# Altium project CAN_GPIO_1.0_RW.PrjPcb
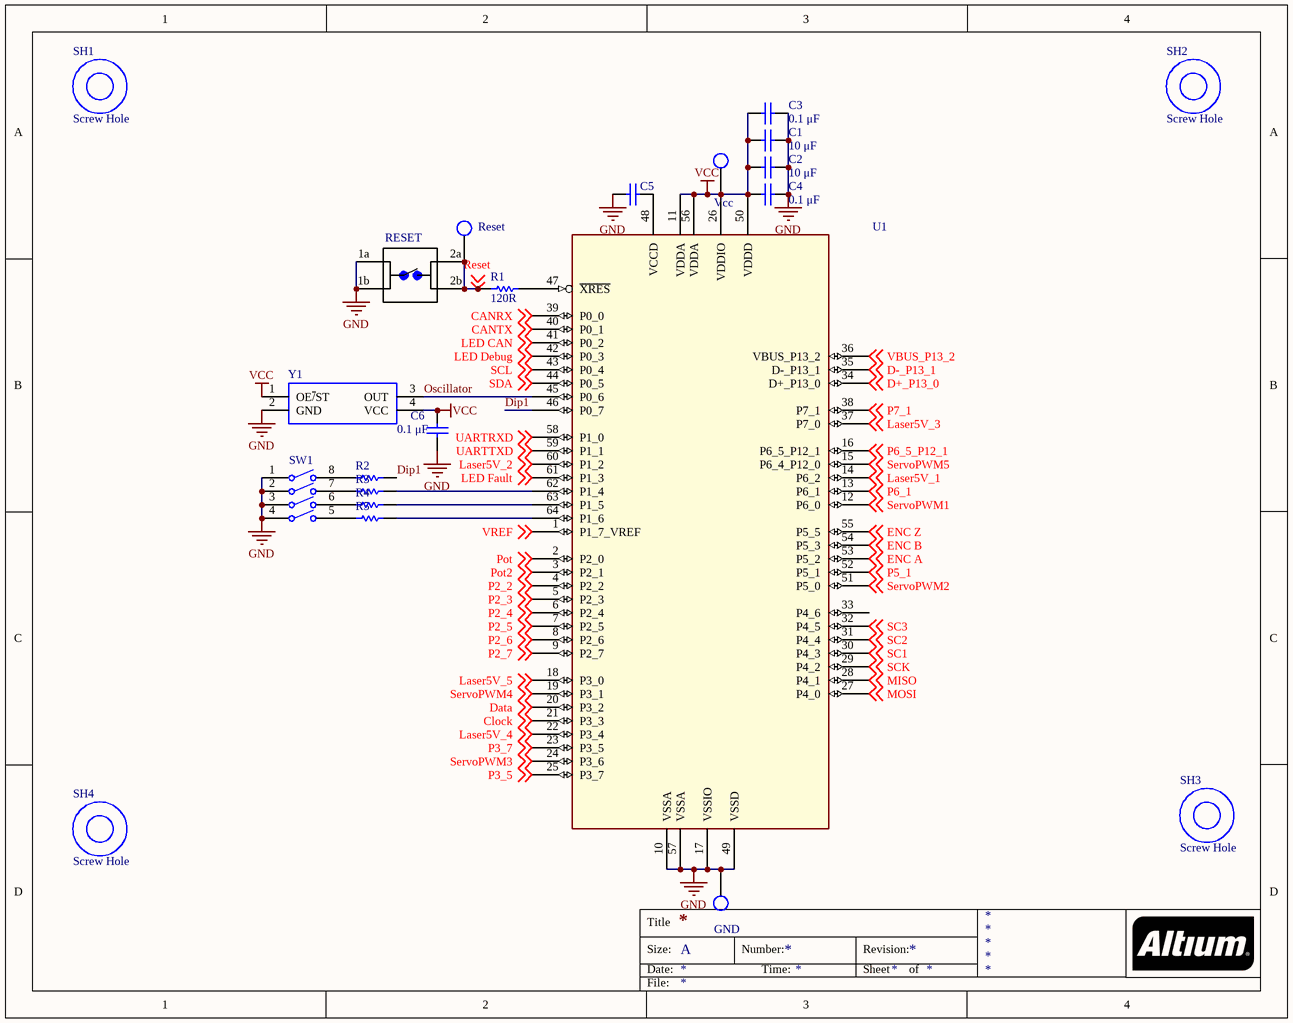
[diagram p0: PSoC.SchDoc]
4 sheets, 141 parts. Net scope: global (net labels, ports and power ports of the same name join across sheets).
Board file: CAN_GPIO_1.0_RW.PcbDoc
Sheets:
  PSoC.SchDoc
  CAN.SchDoc
  LEDs.SchDoc
  Connectors.SchDoc

## Sheet PSoC.SchDoc
size A

### Parts
C1  10 μF  [Cap 0805]
C2  10 μF  [Cap 0805]
C3  0.1 μF  [Cap 0805]
C4  0.1 μF  [Cap 0805]
C5  1 μF  [Cap 0805]  (value not drawn)
C6  0.1 μF  [Cap 0805]
GND  Test Point  [Test Point pad]  (value not drawn)
R1  value 120R  [RESC0805(2012)_N]  (hidden comment: Resistor 0805)
R2  Resistor 0805  [RESC0805(2012)_N]  (value not drawn)
R3  Resistor 0805  [RESC0805(2012)_N]  (value not drawn)
R4  Resistor 0805  [RESC0805(2012)_N]  (value not drawn)
R5  Resistor 0805  [RESC0805(2012)_N]  (value not drawn)
RESET  1825910-7  [Switch 6mm 24V (NO)]  (value not drawn)
Reset  Test Point  [Test Point pad]  (value not drawn)
SH1  Screw Hole  [Screw Hole]
SH2  Screw Hole  [Screw Hole]
SH3  Screw Hole  [Screw Hole]
SH4  Screw Hole  [Screw Hole]
SW1  TDA04H0SB1  [CKCP-TDA04H0SB1R_V]  (value not drawn)
U1  CY8C4248AZI-L485  [TQFP50P1200X1200X160-64N]  (value not drawn)
Vcc  Test Point  [Test Point pad]  (value not drawn)
Y1  SG-636PCW_50.0000MC3__ROHS  [SG-636_3D]  (value not drawn)

### Nets
GND: C1.1 C2.2 C3.1 C4.2 C5.1 C6.1 GND.1 RESET.1a RESET.1b SW1.1 SW1.2 SW1.3 SW1.4 U1.10(VSSA) U1.17(VSSIO) U1.49(VSSD) U1.57(VSSA) Y1.2(GND)
VCC: C1.2 C2.1 C3.2 C4.1 C6.2 U1.11(VDDA) U1.26(VDDIO) U1.50(VDDD) U1.56(VDDA) Vcc.1 Y1.1(OE~{/}ST) Y1.4(VCC)
CANRX: U1.39(P0_0) ; off-sheet CANRX
CANTX: U1.40(P0_1) ; off-sheet CANTX
Clock: U1.21(P3_3) ; off-sheet Clock
D+_P13_0: U1.34(D+_P13_0) ; off-sheet D+_P13_0
D-_P13_1: U1.35(D-_P13_1) ; off-sheet D-_P13_1
Data: U1.20(P3_2) ; off-sheet Data
Dip1: R2.2 U1.46(P0_7)
ENC A: U1.53(P5_2) ; off-sheet ENC A
ENC B: U1.54(P5_3) ; off-sheet ENC B
ENC Z: U1.55(P5_5) ; off-sheet ENC Z
Laser5V_1: U1.14(P6_2) ; off-sheet Laser5V_1
Laser5V_2: U1.60(P1_2) ; off-sheet Laser5V_2
Laser5V_3: U1.37(P7_0) ; off-sheet Laser5V_3
Laser5V_4: U1.22(P3_4) ; off-sheet Laser5V_4
Laser5V_5: U1.18(P3_0) ; off-sheet Laser5V_5
LED CAN: U1.41(P0_2) ; off-sheet LED CAN
LED Debug: U1.42(P0_3) ; off-sheet LED Debug
LED Fault: U1.61(P1_3) ; off-sheet LED Fault
MISO: U1.28(P4_1) ; off-sheet MISO
MOSI: U1.27(P4_0) ; off-sheet MOSI
Oscillator: U1.45(P0_6) Y1.3(OUT)
P2_2: U1.4(P2_2) ; off-sheet P2_2
P2_3: U1.5(P2_3) ; off-sheet P2_3
P2_4: U1.6(P2_4) ; off-sheet P2_4
P2_5: U1.7(P2_5) ; off-sheet P2_5
P2_6: U1.8(P2_6) ; off-sheet P2_6
P2_7: U1.9(P2_7) ; off-sheet P2_7
P3_5: U1.25(P3_7) ; off-sheet P3_5
P3_7: U1.23(P3_5) ; off-sheet P3_7
P5_1: U1.52(P5_1) ; off-sheet P5_1
P6_1: U1.13(P6_1) ; off-sheet P6_1
P6_5_P12_1: U1.16(P6_5_P12_1) ; off-sheet P6_5_P12_1
P7_1: U1.38(P7_1) ; off-sheet P7_1
Pot: U1.2(P2_0) ; off-sheet Pot
Pot2: U1.3(P2_1) ; off-sheet Pot2
Reset: R1.1 Reset.1 RESET.2a RESET.2b ; off-sheet Reset
SC1: U1.30(P4_3) ; off-sheet SC1
SC2: U1.31(P4_4) ; off-sheet SC2
SC3: U1.32(P4_5) ; off-sheet SC3
SCK: U1.29(P4_2) ; off-sheet SCK
SCL: U1.43(P0_4) ; off-sheet SCL
SDA: U1.44(P0_5) ; off-sheet SDA
ServoPWM1: U1.12(P6_0) ; off-sheet ServoPWM1
ServoPWM2: U1.51(P5_0) ; off-sheet ServoPWM2
ServoPWM3: U1.24(P3_6) ; off-sheet ServoPWM3
ServoPWM4: U1.19(P3_1) ; off-sheet ServoPWM4
ServoPWM5: U1.15(P6_4_P12_0) ; off-sheet ServoPWM5
UARTRXD: U1.58(P1_0) ; off-sheet UARTRXD
UARTTXD: U1.59(P1_1) ; off-sheet UARTTXD
VBUS_P13_2: U1.36(VBUS_P13_2) ; off-sheet VBUS_P13_2
VREF: U1.1(P1_7_VREF) ; off-sheet VREF
NetC5_2: C5.2 U1.48(VCCD)
NetR1_2: R1.2 U1.47(~{XRES})
NetR2_1: R2.1 SW1.8
NetR3_1: R3.1 SW1.7
NetR3_2: R3.2 U1.62(P1_4)
NetR4_1: R4.1 SW1.6
NetR4_2: R4.2 U1.63(P1_5)
NetR5_1: R5.1 SW1.5
NetR5_2: R5.2 U1.64(P1_6)

Not connected (* = marked no-connect by the designer): U1 33(P4_6)

### Notes on the sheet
- Title
- Size:
- Date:
- A
- Number:
- Time:
- Revision:
- Sheet
- of
- File:

### Library data of the parts
C1-C6 = Capacitor 0805: Standard Capacitor; Mounting Technology: SurfaceMount; Case Size/Dimension: 0805; Package Reference: 0805
  C1 C2: Capacitance: 10 μF
  C3 C4 C6: Capacitance: 0.1 μF
  C5: Capacitance: 1 μF
R1 = Resistor 0805: Generic 0805 Resistor; Tolerance: 5 %; Case-Metric: 2012; Case-EIA: 0805; Power: 0.125 W; Technology: SMT
R2-R5 = Resistor 0805: Generic 0805 Resistor; Value: 120R; Case-EIA: 0805; Tolerance: 5 %; Case-Metric: 2012; Power: 0.125 W; Technology: SMT
RESET = Switch 6mm 24V (NO): FSM4JAH=6MM TACT SWITCH, HIGH TEMP; MF: TE Connectivity; Contact_Current_Rating: 50 mA; Configuration_Pole-Throw: Single Pole - Single Throw; Package: None; Digi-Key_Part_Number: 450-1804-ND; Digi-Key_Purchase_URL: https://www.digikey.com/product-detail/en/te-connectivity-alcoswitch-switches/1825910-7/450-1804-ND/1731414?utm_source=snapeda&utm_medium=aggregator&utm_campaign=symbol; MP: 1825910-7; SnapEDA_Link: https://www.snapeda.com/parts/1825910-7/TE%20Connectivity%20ALCOSWITCH%20Switches/view-part/?ref=snap; EU_RoHS_Compliance: Compliant; TE_purchase_URL: https://www.te.com/usa-en/product-1825910-7.html?te_bu=Cor&te_type=disp&te_campaign=seda_glo_cor-seda-global-disp-prtnr-fy19-seda-model-bom-cta_sma-317_1&elqCampaignId=32493; Value: *
SH1-SH4 = Screw Hole: Add 4 of these to your design for screw hole mounting
SW1 = Dip Switch Array SMD Half-Pitch: Ultra-Miniature Surface Mount Half-Pitch DIP Switch, 25 mA, 24 V, -40 to 85 degC, 8-Pin SMD, RoHS, Tube; Contact Current Rating: 100 mA; Throw Configuration: SPST; Voltage Rating (DC): 24 V; Max Contact Resistance: 100 mohm; Max Current Rating: 25 mA; REACH SVHC: No SVHC; DatasheetVersion: 02/2016; Case\Package: DIP; Package Quantity: 70; Lead Pitch: 1.27 mm; Contact Plating: Gold; Packaging: Rail/Tube; Contact Finish: Gold; Mount: Surface Mount; Height: 2.3 mm; Contact Material: Copper; Max Operating Temperature: 85 degC; Max Voltage Rating (DC): 24 V; ComponentLink1URL: http://www.ck-components.com/media/1328/tda.pdf; PackageDescription: 8-Pin Surface Mount Device, Body 6.21 x 6.2 mm, Pitch 1.27 mm; Radiation Hardening: No; ComponentLink1Description: Datasheet; Current Rating: 100 mA; RoHSCompliant: true; PackageReference: TDA04H0SB1R; Min Operating Temperature: -40 degC; Pins: 4; Mounting Technology: Surface Mount; Length: 6.21 mm
U1 = PSOC MC: 64 pin psoc; Part_Number: CY8C4248AZI-L485
Y1 = Oscilator: Standard Clock Oscillators; Manufacturer_Name: Epson Timing; Manufacturer_Part_Number: SG-636PCW 50.0000MC3: ROHS; RS Part Number: *; RS Price/Stock: *; Arrow Part Number: SG-636PCW 50.0000MC3: ROHS; Arrow Price/Stock: *; Datasheet Link: http://www.mouser.com/ds/2/137/G-636PCE_en-1003252.pdf

## Sheet CAN.SchDoc
size A
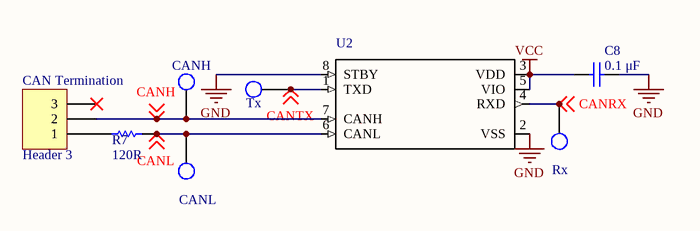
[diagram p1: CAN.SchDoc]

### Parts
(Parts that share a designator on the sheet are numbered #1, #2 ... from top to bottom, then left to right.)
C8  0.1 μF  [Cap 0805]
CAN_Termination  Header 3  [HDR1X3]
CANH  Test Point  [Test Point pad]  (value not drawn)
CANL#1  Test Point  [Test Point pad]  (value not drawn)
R7  120R  [RESC0805(2012)_N]
Rx  Test Point  [Test Point Through-hole]  (value not drawn)
Tx  Test Point  [Test Point Through-hole]  (value not drawn)
U2  MCP2562-E/SN  [SOIC127P600X175-8N]  (value not drawn)

### Nets
GND: C8.2 U2.2(VSS) U2.8(STBY)
VCC: C8.1 U2.3(VDD) U2.5(VIO)
CANH: CAN_Termination.2 CANH.1 U2.7(CANH) ; off-sheet CANH
CANL: CANL#1.1 R7.1 U2.6(CANL) ; off-sheet CANL
CANRX: Rx.1 U2.4(RXD) ; off-sheet CANRX
CANTX: Tx.1 U2.1(TXD) ; off-sheet CANTX
NetCAN_Termination_1: CAN_Termination.1 R7.2

Not connected (* = marked no-connect by the designer): CAN_Termination 3*

### Notes on the sheet
- Title
- Size:
- Date:
- A
- Number:
- Time:
- Revision:
- Sheet
- of
- File:

### Library data of the parts
C8 = Capacitor 0805: Standard Capacitor; Mounting Technology: SurfaceMount; Case Size/Dimension: 0805; Package Reference: 0805; Capacitance: 0.1 μF
CAN_Termination = Header 3: Header, 3-Pin; LatestRevisionDate: 17-Jul-2002; LatestRevisionNote: Re-released for DXP Platform.; Publisher: Altium Limited
R7 = Resistor 0805: as R1 on sheet PSoC; Technology: SMT; Value: 120R
U2 = CAN Tranceiver: Microchip MCP2562-E/SN, CAN Transceiver 1MBps 1-channel IEC 61000-4-2, 8-Pin SOIC; Price: None; MF: Microchip; SnapEDA_Link: https://www.snapeda.com/parts/MCP2562-E/SN/Microchip/view-part/?ref=snap; MP: MCP2562-E/SN; Availability: Unavailable; Package: SO-8 Microchip; Value: *

## Sheet LEDs.SchDoc
size A
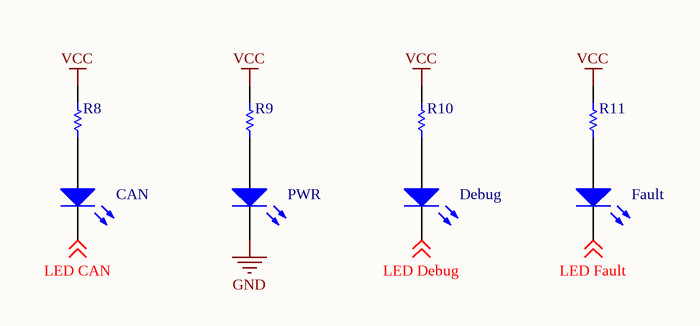
[diagram p2: LEDs.SchDoc]

### Parts
CAN  LED  [0805_A]  (value not drawn)
Debug  LED  [0805_A]  (value not drawn)
Fault  LED  [0805_A]  (value not drawn)
PWR  LED  [0805_A]  (value not drawn)
R8  Resistor 0805  [RESC0805(2012)_N]  (value not drawn)
R9  Resistor 0805  [RESC0805(2012)_N]  (value not drawn)
R10  Resistor 0805  [RESC0805(2012)_N]  (value not drawn)
R11  Resistor 0805  [RESC0805(2012)_N]  (value not drawn)

### Nets
GND: PWR.1(K)
VCC: R8.1 R9.1 R10.1 R11.1
LED CAN: CAN.1(K) ; off-sheet LED CAN
LED Debug: Debug.1(K) ; off-sheet LED Debug
LED Fault: Fault.1(K) ; off-sheet LED Fault
NetCAN_2: CAN.2(A) R8.2
NetDebug_2: Debug.2(A) R10.2
NetFault_2: Fault.2(A) R11.2
NetPWR_2: PWR.2(A) R9.2

### Notes on the sheet
- Title
- Size:
- Date:
- A
- Number:
- Time:
- Revision:
- Sheet
- of
- File:

### Library data of the parts
CAN Fault = LED: Standard 0805 LED; Manufacturer: Wuerth Elektronik; PartNumber: 150080SS75000; PackageReference: 0805_A
  CAN: Color: Blue
  Fault: ComponentLink2URL: http://katalog.we-online.com/led/datasheet/150080SS75000.pdf; ComponentLink1URL: http://www.we-online.com; Color: Super Red; ComponentLink2Description: Datasheet; ComponentLink1Description: Manufacturer URL
Debug PWR = LED: Standard 0805 LED; PackageReference: 0805_A
  Debug: Color: Green
  PWR: Color: Yellow
R8-R11 = Resistor 0805: as R2 on sheet PSoC; Technology: SMT

## Sheet Connectors.SchDoc
size A
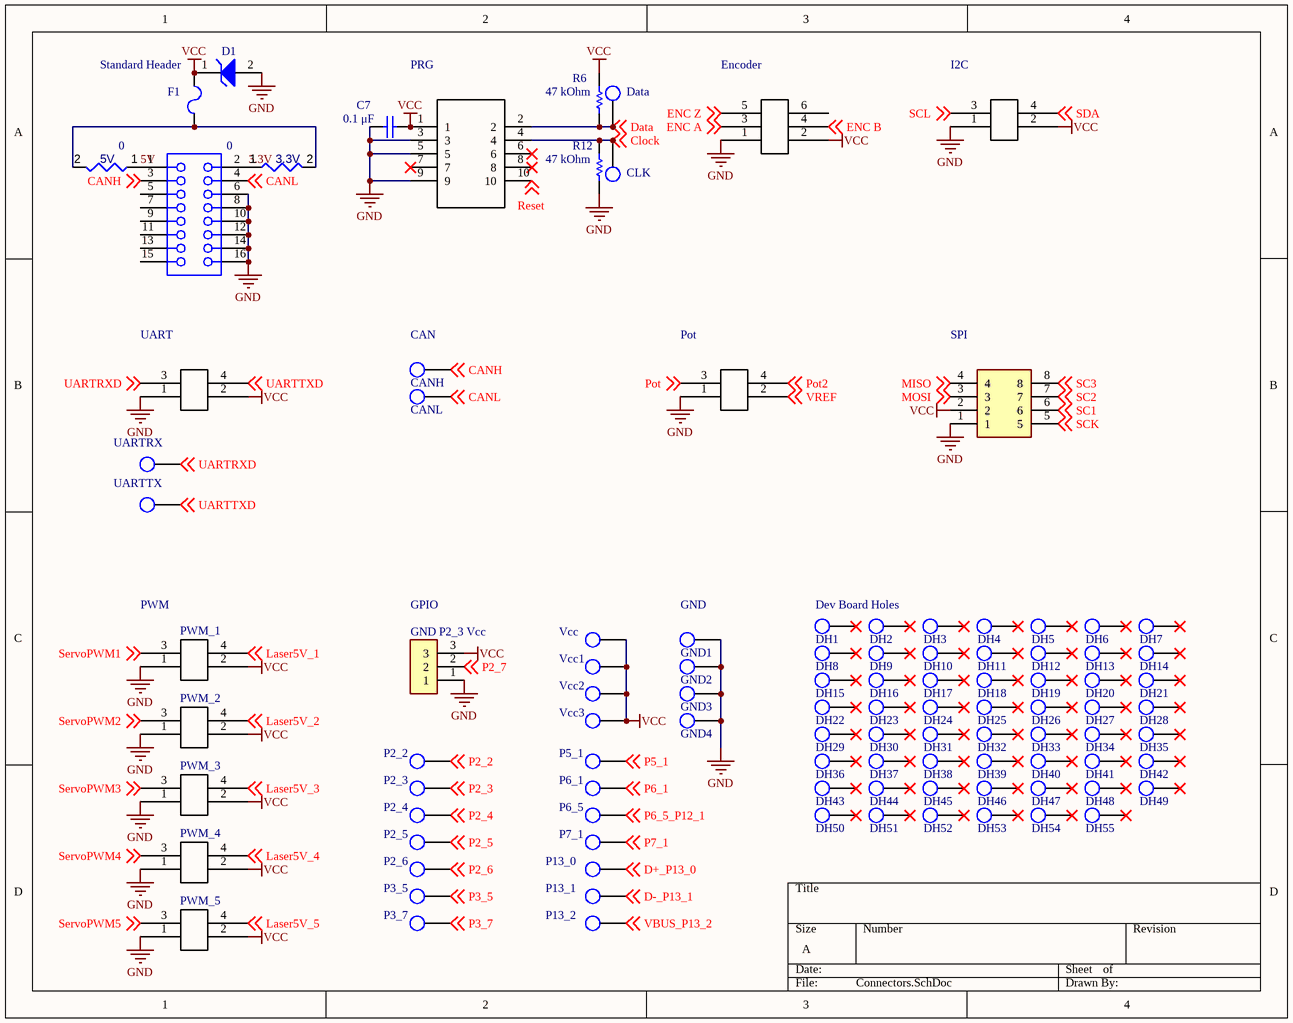
[diagram p3: Connectors.SchDoc]

### Parts
(Parts that share a designator on the sheet are numbered #1, #2 ... from top to bottom, then left to right.)
3.3V  value 0  [RESC0402(1005)_L]  (hidden comment: Jumper)
5V  value 0  [RESC0402(1005)_L]  (hidden comment: Jumper)
C7  0.1 μF  [Cap 0805]
CANH  Test Point  [Test Point Through-hole]  (value not drawn)
CANL#2  Test Point  [Test Point Through-hole]  (value not drawn)
CLK  Test Point  [Test Point pad]  (value not drawn)
D1  1SMB5917BT3G  [ONSC-SMB-2-403A-03_H_V]  (value not drawn)
Data  Test Point  [Test Point pad]  (value not drawn)
DH1  Test Point  [Test Point Through-hole]  (value not drawn)
DH2  Test Point  [Test Point Through-hole]  (value not drawn)
DH3  Test Point  [Test Point Through-hole]  (value not drawn)
DH4  Test Point  [Test Point Through-hole]  (value not drawn)
DH5  Test Point  [Test Point Through-hole]  (value not drawn)
DH6  Test Point  [Test Point Through-hole]  (value not drawn)
DH7  Test Point  [Test Point Through-hole]  (value not drawn)
DH8  Test Point  [Test Point Through-hole]  (value not drawn)
DH9  Test Point  [Test Point Through-hole]  (value not drawn)
DH10  Test Point  [Test Point Through-hole]  (value not drawn)
DH11  Test Point  [Test Point Through-hole]  (value not drawn)
DH12  Test Point  [Test Point Through-hole]  (value not drawn)
DH13  Test Point  [Test Point Through-hole]  (value not drawn)
DH14  Test Point  [Test Point Through-hole]  (value not drawn)
DH15  Test Point  [Test Point Through-hole]  (value not drawn)
DH16  Test Point  [Test Point Through-hole]  (value not drawn)
DH17  Test Point  [Test Point Through-hole]  (value not drawn)
DH18  Test Point  [Test Point Through-hole]  (value not drawn)
DH19  Test Point  [Test Point Through-hole]  (value not drawn)
DH20  Test Point  [Test Point Through-hole]  (value not drawn)
DH21  Test Point  [Test Point Through-hole]  (value not drawn)
DH22  Test Point  [Test Point Through-hole]  (value not drawn)
DH23  Test Point  [Test Point Through-hole]  (value not drawn)
DH24  Test Point  [Test Point Through-hole]  (value not drawn)
DH25  Test Point  [Test Point Through-hole]  (value not drawn)
DH26  Test Point  [Test Point Through-hole]  (value not drawn)
DH27  Test Point  [Test Point Through-hole]  (value not drawn)
DH28  Test Point  [Test Point Through-hole]  (value not drawn)
DH29  Test Point  [Test Point Through-hole]  (value not drawn)
DH30  Test Point  [Test Point Through-hole]  (value not drawn)
DH31  Test Point  [Test Point Through-hole]  (value not drawn)
DH32  Test Point  [Test Point Through-hole]  (value not drawn)
DH33  Test Point  [Test Point Through-hole]  (value not drawn)
DH34  Test Point  [Test Point Through-hole]  (value not drawn)
DH35  Test Point  [Test Point Through-hole]  (value not drawn)
DH36  Test Point  [Test Point Through-hole]  (value not drawn)
DH37  Test Point  [Test Point Through-hole]  (value not drawn)
DH38  Test Point  [Test Point Through-hole]  (value not drawn)
DH39  Test Point  [Test Point Through-hole]  (value not drawn)
DH40  Test Point  [Test Point Through-hole]  (value not drawn)
DH41  Test Point  [Test Point Through-hole]  (value not drawn)
DH42  Test Point  [Test Point Through-hole]  (value not drawn)
DH43  Test Point  [Test Point Through-hole]  (value not drawn)
DH44  Test Point  [Test Point Through-hole]  (value not drawn)
DH45  Test Point  [Test Point Through-hole]  (value not drawn)
DH46  Test Point  [Test Point Through-hole]  (value not drawn)
DH47  Test Point  [Test Point Through-hole]  (value not drawn)
DH48  Test Point  [Test Point Through-hole]  (value not drawn)
DH49  Test Point  [Test Point Through-hole]  (value not drawn)
DH50  Test Point  [Test Point Through-hole]  (value not drawn)
DH51  Test Point  [Test Point Through-hole]  (value not drawn)
DH52  Test Point  [Test Point Through-hole]  (value not drawn)
DH53  Test Point  [Test Point Through-hole]  (value not drawn)
DH54  Test Point  [Test Point Through-hole]  (value not drawn)
DH55  Test Point  [Test Point Through-hole]  (value not drawn)
Encoder  Molex Micro  [MICROFIT R/A 6 PIN]  (value not drawn)
F1  MF-NSMF150-2  [BOUR-MF-NSMF150-2_V]  (value not drawn)
GND1  Test Point  [Test Point Through-hole]  (value not drawn)
GND2  Test Point  [Test Point Through-hole]  (value not drawn)
GND3  Test Point  [Test Point Through-hole]  (value not drawn)
GND4  Test Point  [Test Point Through-hole]  (value not drawn)
GND_P2_3_Vcc  1985836  [PHOENIX_1985836]  (value not drawn)
I2C  Molex Micro  [MICROFIT R/A 4 PIN]  (value not drawn)
P2_2  Test Point  [Test Point Through-hole]  (value not drawn)
P2_3  Test Point  [Test Point Through-hole]  (value not drawn)
P2_4  Test Point  [Test Point Through-hole]  (value not drawn)
P2_5  Test Point  [Test Point Through-hole]  (value not drawn)
P2_6  Test Point  [Test Point Through-hole]  (value not drawn)
P3_5  Test Point  [Test Point Through-hole]  (value not drawn)
P3_7  Test Point  [Test Point Through-hole]  (value not drawn)
P5_1  Test Point  [Test Point Through-hole]  (value not drawn)
P6_1  Test Point  [Test Point Through-hole]  (value not drawn)
P6_5  Test Point  [Test Point Through-hole]  (value not drawn)
P7_1  Test Point  [Test Point Through-hole]  (value not drawn)
P13_0  Test Point  [Test Point Through-hole]  (value not drawn)
P13_1  Test Point  [Test Point Through-hole]  (value not drawn)
P13_2  Test Point  [Test Point Through-hole]  (value not drawn)
Pot  Molex Micro  [MICROFIT R/A 4 PIN]  (value not drawn)
PRG  Programming Header  [programming3D]  (value not drawn)
PWM_1  Molex Micro  [MICROFIT R/A 4 PIN]  (value not drawn)
PWM_2  Molex Micro  [MICROFIT R/A 4 PIN]  (value not drawn)
PWM_3  Molex Micro  [MICROFIT R/A 4 PIN]  (value not drawn)
PWM_4  Molex Micro  [MICROFIT R/A 4 PIN]  (value not drawn)
PWM_5  Molex Micro  [MICROFIT R/A 4 PIN]  (value not drawn)
R6  47 kOhm  [RESC0805(2012)_N]
R12  47 kOhm  [RESC0805(2012)_N]
SPI  Molex micro-fit 8-pin  [MICROFIT R/A 8 PIN]  (value not drawn)
Standard_Header  Stacking Header  [SMTC-SSQ-108-02-X-D]  (value not drawn)
UART  Molex Micro  [MICROFIT R/A 4 PIN]  (value not drawn)
UARTRX  Test Point  [Test Point Through-hole]  (value not drawn)
UARTTX  Test Point  [Test Point Through-hole]  (value not drawn)
Vcc  Test Point  [Test Point Through-hole]  (value not drawn)
Vcc1  Test Point  [Test Point Through-hole]  (value not drawn)
Vcc2  Test Point  [Test Point Through-hole]  (value not drawn)
Vcc3  Test Point  [Test Point Through-hole]  (value not drawn)

### Nets
GND: C7.1 D1.2(A) Encoder.1 GND1.1 GND2.1 GND3.1 GND4.1 GND_P2_3_Vcc.1 I2C.1 Pot.1 PRG.3 PRG.5 PRG.9 PWM_1.1 PWM_2.1 PWM_3.1 PWM_4.1 PWM_5.1 R12.1 SPI.1 Standard_Header.6 Standard_Header.8 Standard_Header.10 Standard_Header.12 Standard_Header.14 Standard_Header.16 UART.1
VCC: C7.2 D1.1(K) Encoder.2 F1.2 GND_P2_3_Vcc.3 I2C.2 PRG.1 PWM_1.2 PWM_2.2 PWM_3.2 PWM_4.2 PWM_5.2 R6.2 SPI.2 UART.2 Vcc.1 Vcc1.1 Vcc2.1 Vcc3.1
3.3V: 3.3V.1 Standard_Header.2
5V: 5V.1 Standard_Header.1
CANH: CANH.1 Standard_Header.3 ; off-sheet CANH
CANL: CANL#2.1 Standard_Header.4 ; off-sheet CANL
Clock: CLK.1 PRG.4 R12.2 ; off-sheet Clock
D+_P13_0: P13_0.1 ; off-sheet D+_P13_0
D-_P13_1: P13_1.1 ; off-sheet D-_P13_1
Data: Data.1 PRG.2 R6.1 ; off-sheet Data
ENC A: Encoder.3 ; off-sheet ENC A
ENC B: Encoder.4 ; off-sheet ENC B
ENC Z: Encoder.5 ; off-sheet ENC Z
Laser5V_1: PWM_1.4 ; off-sheet Laser5V_1
Laser5V_2: PWM_2.4 ; off-sheet Laser5V_2
Laser5V_3: PWM_3.4 ; off-sheet Laser5V_3
Laser5V_4: PWM_4.4 ; off-sheet Laser5V_4
Laser5V_5: PWM_5.4 ; off-sheet Laser5V_5
MISO: SPI.4 ; off-sheet MISO
MOSI: SPI.3 ; off-sheet MOSI
P2_2: P2_2.1 ; off-sheet P2_2
P2_3: P2_3.1 ; off-sheet P2_3
P2_4: P2_4.1 ; off-sheet P2_4
P2_5: P2_5.1 ; off-sheet P2_5
P2_6: P2_6.1 ; off-sheet P2_6
P2_7: GND_P2_3_Vcc.2 ; off-sheet P2_7
P3_5: P3_5.1 ; off-sheet P3_5
P3_7: P3_7.1 ; off-sheet P3_7
P5_1: P5_1.1 ; off-sheet P5_1
P6_1: P6_1.1 ; off-sheet P6_1
P6_5_P12_1: P6_5.1 ; off-sheet P6_5_P12_1
P7_1: P7_1.1 ; off-sheet P7_1
Pot: Pot.3 ; off-sheet Pot
Pot2: Pot.4 ; off-sheet Pot2
Reset: PRG.10 ; off-sheet Reset
SC1: SPI.6 ; off-sheet SC1
SC2: SPI.7 ; off-sheet SC2
SC3: SPI.8 ; off-sheet SC3
SCK: SPI.5 ; off-sheet SCK
SCL: I2C.3 ; off-sheet SCL
SDA: I2C.4 ; off-sheet SDA
ServoPWM1: PWM_1.3 ; off-sheet ServoPWM1
ServoPWM2: PWM_2.3 ; off-sheet ServoPWM2
ServoPWM3: PWM_3.3 ; off-sheet ServoPWM3
ServoPWM4: PWM_4.3 ; off-sheet ServoPWM4
ServoPWM5: PWM_5.3 ; off-sheet ServoPWM5
UARTRXD: UART.3 UARTRX.1 ; off-sheet UARTRXD
UARTTXD: UART.4 UARTTX.1 ; off-sheet UARTTXD
VBUS_P13_2: P13_2.1 ; off-sheet VBUS_P13_2
VREF: Pot.2 ; off-sheet VREF
Net3.3V_2: 3.3V.2 5V.2 F1.1

Not connected (* = marked no-connect by the designer): DH1 1*; DH2 1*; DH3 1*; DH4 1*; DH5 1*; DH6 1*; DH7 1*; DH8 1*; DH9 1*; DH10 1*; DH11 1*; DH12 1*; DH13 1*; DH14 1*; DH15 1*; DH16 1*; DH17 1*; DH18 1*; DH19 1*; DH20 1*; DH21 1*; DH22 1*; DH23 1*; DH24 1*; DH25 1*; DH26 1*; DH27 1*; DH28 1*; DH29 1*; DH30 1*; DH31 1*; DH32 1*; DH33 1*; DH34 1*; DH35 1*; DH36 1*; DH37 1*; DH38 1*; DH39 1*; DH40 1*; DH41 1*; DH42 1*; DH43 1*; DH44 1*; DH45 1*; DH46 1*; DH47 1*; DH48 1*; DH49 1*; DH50 1*; DH51 1*; DH52 1*; DH53 1*; DH54 1*; DH55 1*; Encoder 6; PRG 6* 7* 8*; Standard_Header 5 7 9 11 13 15

### Notes on the sheet
- (near CANH) CAN
- (near PWM_1) PWM
- (near GND_P2_3_Vcc) GPIO
- (near GND1) GND
- Dev Board Holes

### Library data of the parts
3.3V 5V = CMP-009-00062-1: Jumper 0402 (1005 Metric); Pins: 2; Case/Package: 0402; Mounting Technology: SMT
C7 = Capacitor 0805: Standard Capacitor; Mounting Technology: SurfaceMount; Case Size/Dimension: 0805; Package Reference: 0805; Capacitance: 0.1 μF
D1 = Zener Diode 5.1V: 3 W Zener Voltage Regulator, 2-Pin SMB, Pb-Free, Tape and Reel; Manufacturer: On Semiconductor; VZ Typ (V): 4.7; RoHS: Pb-Free; ComponentLink1Description: Manufacturer URL; ComponentLink2URL: http://www.onsemi.com/pub_link/Collateral/1SMB5913BT3-D.PDF; Mounting Technology: Surface Mount; PackageVersion: Rev. H, 05/2011; DatasheetVersion: Rev. 8; Packing: Tape and Reel; PartNumber: 1SMB5917BT3G; ComponentLink2Description: Datasheet; ComponentLink3Description: Package Specification; PackageReference: SMB-2-403A-03_H; ComponentLink1URL: http://www.onsemi.com/; PackageDescription: 2-Pin Small Molded Package, J-Bend Lead, Body 4.33 x 3.625 mm; ComponentLink3URL: http://www.onsemi.com/pub_link/Collateral/1SMB5913BT3-D.PDF
Encoder = Molex micro-fit 6-pin (dual row schematic): Molex micro-fit 3.0 dual row connector. P/N 0430450627
F1 = CMP-2000-06693-1: PTC Resettable Fuse, 6 V, 100 A, -40 to 85 degC, 2-Pin SMD, RoHS, Tape and Reel; Manufacturer: Bourns; Trip Current: 3A; Maximum Voltage DC: 6V; Current Rating: 100A; Resistance: 130mOhms; Type: PTCResettableFuses; Hold Current: 1.5A; Maximum Voltage: 6VDC; RoHS: Details; Current Rating (Max): 100A; Datasheet URL: http://www.bourns.com/docs/Product-Datasheets/mfnsmf.pdf; Package Description: 2-Pin Surface Mount Device, Body 3.2 x 1.6 mm; Series: MF-NSMF; Mounting Technology: SurfaceMount; Dimensions: 3.4mmLx1.8mmWx0.7mmH; Termination Style: SMD/SMT; Datasheet Version: Rev. T, 08/2015; Package / Case: 1206(3216metric); Manufacturer URL: http://www.bourns.com/; Product Category: ResettableFuses-PPTC; Packaging: Reel; Brand: Bourns; Mounting Style: SMD/SMT; Package Reference: MF-NSMF150-2; Current Rating - Max: 100A; Tradename: Multifuse; Factory Pack Quantity: 3000; Operating Temperature Range: -40Cto+85C
GND_P2_3_Vcc = 1985836: 3 Position Wire to Board Terminal Block Horizontal with Board 0.150 _3.81mm_ Through Hole; MF: Phoenix Contact; Value: *; Package: None; Price: None; MP: 1985836; Availability: Unavailable; SnapEDA_Link: https://www.snapeda.com/parts/1985836/Phoenix%20Contact/view-part/2770711/?ref=snap
I2C Pot PWM_1-PWM_5 UART = Molex micro-fit 4-pin (dual row schematic): Molex micro-fit 3.0, P/N 0430450427
R6 R12 = Resistor 0805: Generic 0805 Resistor; Case-EIA: 0805; Technology: SMT; Value: 47 kOhm
Standard_Header = Stacking Header: SQ Post Socket, Through-hole, Vertical, -55 to 125 degC, 2.54 mm Pitch, 16-Pin, Female, RoHS; Manufacturer: Samtec; PartNumber: SSQ-108-02-G-D; Pitch: 2.54 mm; ComponentLink2URL: http://www.samtec.com/documents/webfiles/pdf/SSQ_TH.PDF; ComponentLink3Description: Package Specification; Mounting Technology: Through-hole; RoHS: True; PackageReference: SSQ-108-02-X-D; Orientation: Vertical; ComponentLink1URL: http://www.samtec.com; DatasheetVersion: F-214; Temperature Range: -55 to 125 degC; PackageDescription: Assembly, Socket Strip .025[0.64] SQ Tail; PackageVersion: BD, 6/1987; ComponentLink2Description: Datasheet; ComponentLink1Description: Manufacturer URL; ComponentLink3URL: http://www.samtec.com/documents/webfiles/cpdf/SSQ-1XX-XX-XXX-X-XX-XXX-XX-X-MKT.pdf

## Nets that join several sheets
GND: PSoC (18 pins), CAN (C8.2 U2.2 U2.8), LEDs (PWR.1), Connectors (27 pins)
VCC: PSoC (12 pins), CAN (C8.1 U2.3 U2.5), LEDs (R8.1 R9.1 R10.1 R11.1), Connectors (19 pins)
CANH: CAN (CAN_Termination.2 CANH.1 U2.7), Connectors (CANH.1 Standard_Header.3)
CANL: CAN (CANL#1.1 R7.1 U2.6), Connectors (CANL#2.1 Standard_Header.4)
CANRX: PSoC (U1.39), CAN (Rx.1 U2.4)
CANTX: PSoC (U1.40), CAN (Tx.1 U2.1)
Clock: PSoC (U1.21), Connectors (CLK.1 PRG.4 R12.2)
D+_P13_0: PSoC (U1.34), Connectors (P13_0.1)
D-_P13_1: PSoC (U1.35), Connectors (P13_1.1)
Data: PSoC (U1.20), Connectors (Data.1 PRG.2 R6.1)
ENC A: PSoC (U1.53), Connectors (Encoder.3)
ENC B: PSoC (U1.54), Connectors (Encoder.4)
ENC Z: PSoC (U1.55), Connectors (Encoder.5)
Laser5V_1: PSoC (U1.14), Connectors (PWM_1.4)
Laser5V_2: PSoC (U1.60), Connectors (PWM_2.4)
Laser5V_3: PSoC (U1.37), Connectors (PWM_3.4)
Laser5V_4: PSoC (U1.22), Connectors (PWM_4.4)
Laser5V_5: PSoC (U1.18), Connectors (PWM_5.4)
LED CAN: PSoC (U1.41), LEDs (CAN.1)
LED Debug: PSoC (U1.42), LEDs (Debug.1)
LED Fault: PSoC (U1.61), LEDs (Fault.1)
MISO: PSoC (U1.28), Connectors (SPI.4)
MOSI: PSoC (U1.27), Connectors (SPI.3)
P2_2: PSoC (U1.4), Connectors (P2_2.1)
P2_3: PSoC (U1.5), Connectors (P2_3.1)
P2_4: PSoC (U1.6), Connectors (P2_4.1)
P2_5: PSoC (U1.7), Connectors (P2_5.1)
P2_6: PSoC (U1.8), Connectors (P2_6.1)
P2_7: PSoC (U1.9), Connectors (GND_P2_3_Vcc.2)
P3_5: PSoC (U1.25), Connectors (P3_5.1)
P3_7: PSoC (U1.23), Connectors (P3_7.1)
P5_1: PSoC (U1.52), Connectors (P5_1.1)
P6_1: PSoC (U1.13), Connectors (P6_1.1)
P6_5_P12_1: PSoC (U1.16), Connectors (P6_5.1)
P7_1: PSoC (U1.38), Connectors (P7_1.1)
Pot: PSoC (U1.2), Connectors (Pot.3)
Pot2: PSoC (U1.3), Connectors (Pot.4)
Reset: PSoC (R1.1 Reset.1 RESET.2a RESET.2b), Connectors (PRG.10)
SC1: PSoC (U1.30), Connectors (SPI.6)
SC2: PSoC (U1.31), Connectors (SPI.7)
SC3: PSoC (U1.32), Connectors (SPI.8)
SCK: PSoC (U1.29), Connectors (SPI.5)
SCL: PSoC (U1.43), Connectors (I2C.3)
SDA: PSoC (U1.44), Connectors (I2C.4)
ServoPWM1: PSoC (U1.12), Connectors (PWM_1.3)
ServoPWM2: PSoC (U1.51), Connectors (PWM_2.3)
ServoPWM3: PSoC (U1.24), Connectors (PWM_3.3)
ServoPWM4: PSoC (U1.19), Connectors (PWM_4.3)
ServoPWM5: PSoC (U1.15), Connectors (PWM_5.3)
UARTRXD: PSoC (U1.58), Connectors (UART.3 UARTRX.1)
UARTTXD: PSoC (U1.59), Connectors (UART.4 UARTTX.1)
VBUS_P13_2: PSoC (U1.36), Connectors (P13_2.1)
VREF: PSoC (U1.1), Connectors (Pot.2)